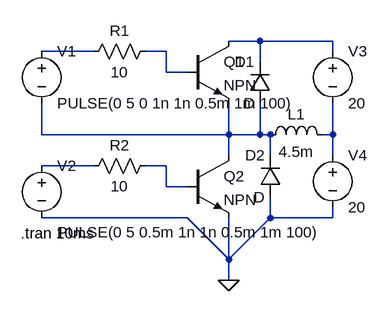
[diagram p0: schematic Draft1.asc]
Draft1.asc, the LTspice schematic file:
Version 4
SHEET 1 880 680
WIRE 576 160 528 160
WIRE 688 160 576 160
WIRE 320 176 240 176
WIRE 432 176 400 176
WIRE 688 176 688 160
WIRE 576 192 576 160
WIRE 432 208 432 176
WIRE 464 208 432 208
WIRE 240 304 240 256
WIRE 528 304 528 256
WIRE 528 304 240 304
WIRE 576 304 576 256
WIRE 576 304 528 304
WIRE 592 304 576 304
WIRE 688 304 688 256
WIRE 688 304 672 304
WIRE 528 336 528 304
WIRE 592 336 592 304
WIRE 688 336 688 304
WIRE 320 352 240 352
WIRE 432 352 400 352
WIRE 432 384 432 352
WIRE 464 384 432 384
WIRE 464 432 240 432
WIRE 592 432 592 400
WIRE 688 432 688 416
WIRE 688 432 592 432
WIRE 528 496 464 432
WIRE 528 496 528 432
WIRE 528 496 592 432
WIRE 528 528 528 496
FLAG 528 528 0
SYMBOL res 416 160 R90
WINDOW 0 0 56 VBottom 2
WINDOW 3 32 56 VTop 2
SYMATTR InstName R1
SYMATTR Value 10
SYMBOL res 416 336 R90
WINDOW 0 0 56 VBottom 2
WINDOW 3 32 56 VTop 2
SYMATTR InstName R2
SYMATTR Value 10
SYMBOL voltage 240 160 R0
WINDOW 123 0 0 Left 0
WINDOW 39 0 0 Left 0
SYMATTR InstName V1
SYMATTR Value PULSE(0 5 0 1n 1n 0.5m 1m 100)
SYMBOL voltage 240 336 R0
WINDOW 123 0 0 Left 0
WINDOW 39 0 0 Left 0
WINDOW 3 24 118 Left 2
SYMATTR InstName V2
SYMATTR Value PULSE(0 5 0.5m 1n 1n 0.5m 1m 100)
SYMBOL voltage 688 160 R0
WINDOW 123 0 0 Left 0
WINDOW 39 0 0 Left 0
SYMATTR InstName V3
SYMATTR Value 20
SYMBOL voltage 688 320 R0
WINDOW 123 0 0 Left 0
WINDOW 39 0 0 Left 0
SYMATTR InstName V4
SYMATTR Value 20
SYMBOL npn 464 160 R0
SYMATTR InstName Q1
SYMBOL npn 464 336 R0
SYMATTR InstName Q2
SYMBOL diode 592 256 R180
WINDOW 0 24 64 Left 2
WINDOW 3 24 0 Left 2
SYMATTR InstName D1
SYMBOL diode 608 400 R180
WINDOW 0 24 64 Left 2
WINDOW 3 24 0 Left 2
SYMATTR InstName D2
SYMBOL ind 576 320 R270
WINDOW 0 32 56 VTop 2
WINDOW 3 5 56 VBottom 2
SYMATTR InstName L1
SYMATTR Value 4.5m
TEXT 208 456 Left 2 !.tran 10ms

The netlist it stands for:
* Draft1.asc
R1 N003 N002 10
R2 N007 N006 10
V1 N002 N004 PULSE(0 5 0 1n 1n 0.5m 1m 100)
V2 N006 0 PULSE(0 5 0.5m 1n 1n 0.5m 1m 100)
V3 N001 N005 20
V4 N005 0 20
Q1 N001 N003 N004 0 NPN
Q2 N004 N007 0 0 NPN
D1 N004 N001 D
D2 0 N004 D
L1 N004 N005 4.5m
.model D D
.lib standard.dio
.model NPN NPN
.model PNP PNP
.lib standard.bjt
.tran 10ms
.backanno
.end